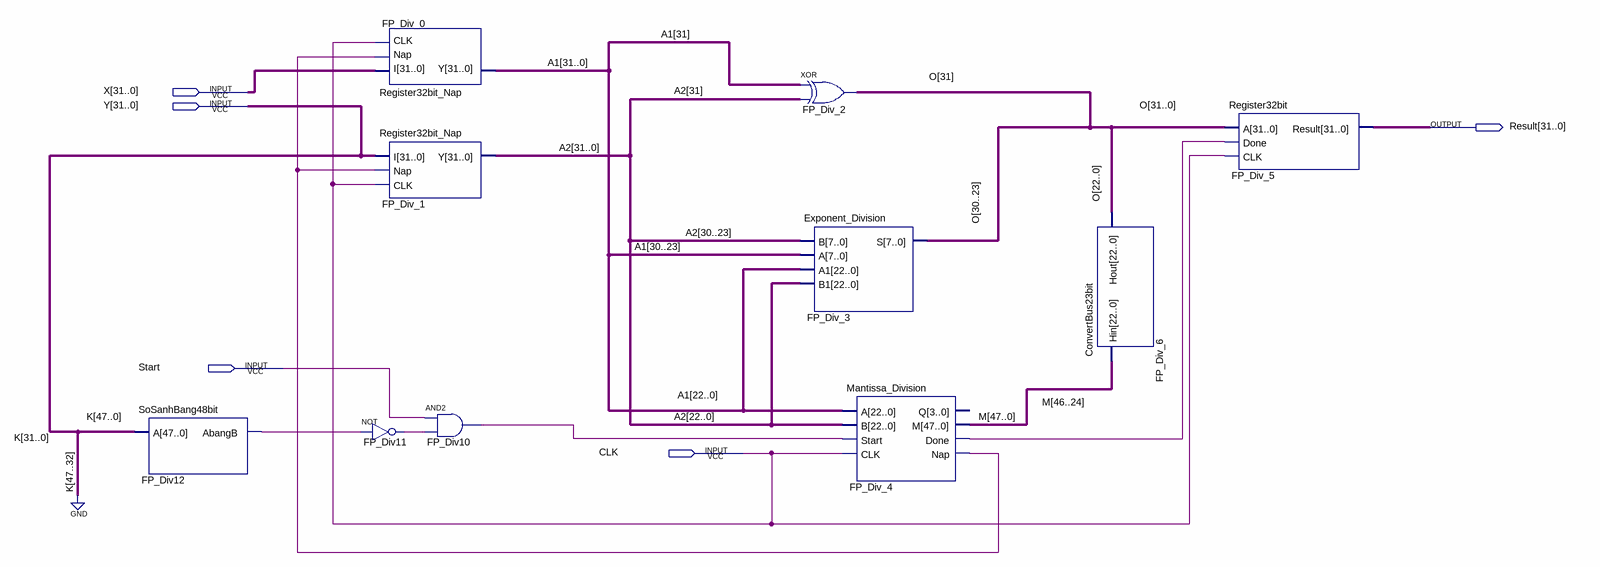
[diagram p0: schematic sheet]
// Quartus schematic FloatingPointDivision.bdf as structural Verilog: 10 symbols, 5 pins
module FloatingPointDivision (
  input  [31:0] X,
  input  [31:0] Y,
  input  Start,
  input  CLK,
  output [31:0] Result
);

  wire FP_Div10_out, FP_Div11_out, FP_Div12_abangb, FP_Div_4_done, FP_Div_4_nap;
  wire [31:0] A1, A2, O;
  wire [47:0] M;

  SoSanhBang48bit FP_Div12 (.A({{16{1'b0}}, Y}), .AbangB(FP_Div12_abangb));
  Register32bit_Nap FP_Div_0 (.I(X), .Nap(FP_Div_4_nap), .CLK(CLK), .Y(A1));
  Register32bit_Nap FP_Div_1 (.I(Y), .Nap(FP_Div_4_nap), .CLK(CLK), .Y(A2));
  not FP_Div11 (FP_Div11_out, FP_Div12_abangb);
  and FP_Div10 (FP_Div10_out, Start, FP_Div11_out);
  xor FP_Div_2 (O[31], A1[31], A2[31]);
  Exponent_Division FP_Div_3 (.B(A2[30:23]), .A(A1[30:23]), .A1(A1[22:0]), .B1(A2[22:0]), .S(O[30:23]));
  Mantissa_Division FP_Div_4 (
    .A(A1[22:0]), .B(A2[22:0]), .Start(FP_Div10_out), .CLK(CLK), .M(M), .Done(FP_Div_4_done),
    .Nap(FP_Div_4_nap));  // open: Q
  ConvertBus23bit FP_Div_6 (.Hin(M[46:24]), .Hout(O[22:0]));
  Register32bit FP_Div_5 (.A(O), .Done(FP_Div_4_done), .CLK(CLK), .Result(Result));

  // Other names for the same wires on the sheet: K[31:0] = Y
endmodule
